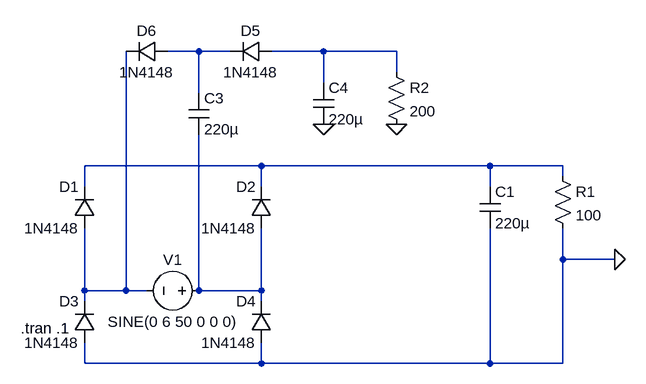
[diagram p0: schematic Draft6.asc]
Draft6.asc, the LTspice schematic file:
Version 4
SHEET 1 880 680
WIRE 128 -112 80 -112
WIRE 176 -112 128 -112
WIRE 320 -112 240 -112
WIRE 432 -112 320 -112
WIRE 432 -80 432 -112
WIRE 320 -64 320 -112
WIRE 128 -48 128 -112
WIRE 224 64 -48 64
WIRE 576 64 224 64
WIRE 688 64 576 64
WIRE 688 80 688 64
WIRE -48 96 -48 64
WIRE 224 96 224 64
WIRE 576 96 576 64
WIRE 688 208 688 160
WIRE 768 208 688 208
WIRE -48 256 -48 160
WIRE 16 256 16 -112
WIRE 16 256 -48 256
WIRE 48 256 16 256
WIRE 128 256 128 16
WIRE 224 256 224 160
WIRE 224 256 128 256
WIRE -48 272 -48 256
WIRE 224 272 224 256
WIRE -48 368 -48 336
WIRE 224 368 224 336
WIRE 224 368 -48 368
WIRE 576 368 576 160
WIRE 576 368 224 368
WIRE 688 368 688 208
WIRE 688 368 576 368
FLAG 768 208 0
FLAG 320 0 0
FLAG 432 0 0
SYMBOL diode -32 160 R180
WINDOW 0 24 64 Left 2
WINDOW 3 24 0 Left 2
SYMATTR InstName D1
SYMATTR Value 1N4148
SYMBOL diode 240 160 R180
WINDOW 0 24 64 Left 2
WINDOW 3 24 0 Left 2
SYMATTR InstName D2
SYMATTR Value 1N4148
SYMBOL diode -32 336 R180
WINDOW 0 24 64 Left 2
WINDOW 3 24 0 Left 2
SYMATTR InstName D3
SYMATTR Value 1N4148
SYMBOL diode 240 336 R180
WINDOW 0 24 64 Left 2
WINDOW 3 24 0 Left 2
SYMATTR InstName D4
SYMATTR Value 1N4148
SYMBOL voltage 144 256 R90
WINDOW 0 -32 56 VBottom 2
WINDOW 3 32 56 VTop 2
WINDOW 123 0 0 Left 0
WINDOW 39 0 0 Left 0
SYMATTR InstName V1
SYMATTR Value SINE(0 6 50 0 0 0)
SYMBOL cap 560 96 R0
SYMATTR InstName C1
SYMATTR Value 220µ
SYMATTR SpiceLine Rser=0.05
SYMBOL res 672 64 R0
SYMATTR InstName R1
SYMATTR Value 100
SYMBOL diode 240 -128 R90
WINDOW 0 0 32 VBottom 2
WINDOW 3 32 32 VTop 2
SYMATTR InstName D5
SYMATTR Value 1N4148
SYMBOL diode 80 -128 R90
WINDOW 0 0 32 VBottom 2
WINDOW 3 32 32 VTop 2
SYMATTR InstName D6
SYMATTR Value 1N4148
SYMBOL cap 112 -48 R0
SYMATTR InstName C3
SYMATTR Value 220µ
SYMATTR SpiceLine Rser=0.05
SYMBOL cap 304 -64 R0
SYMATTR InstName C4
SYMATTR Value 220µ
SYMATTR SpiceLine Rser=0.05
SYMBOL res 416 -96 R0
SYMATTR InstName R2
SYMATTR Value 200
TEXT -146 314 Left 2 !.tran .1

The netlist it stands for:
* Draft6.asc
D1 N004 N003 1N4148
D2 N005 N003 1N4148
D3 0 N004 1N4148
D4 0 N005 1N4148
V1 N005 N004 SINE(0 6 50 0 0 0)
C1 N003 0 220µ Rser=0.05
R1 N003 0 100
D5 N002 N001 1N4148
D6 N001 N004 1N4148
C3 N001 N005 220µ Rser=0.05
C4 N002 0 220µ Rser=0.05
R2 N002 0 200
.model D D
.lib standard.dio
.tran .1
.backanno
.end